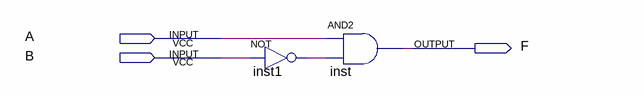
[diagram p0: schematic sheet]
// Quartus schematic maiorque.bdf as structural Verilog: 2 symbols, 3 pins
module maiorque (
  input  A,
  input  B,
  output F
);

  wire inst1_out;

  not inst1 (inst1_out, B);
  and inst (F, A, inst1_out);
endmodule
